# Altium schematic sheet sys.SchDoc: Systems (Debugging)
size A4; DocumentNumber: 8; SheetNumber: 8; SheetTotal: 8
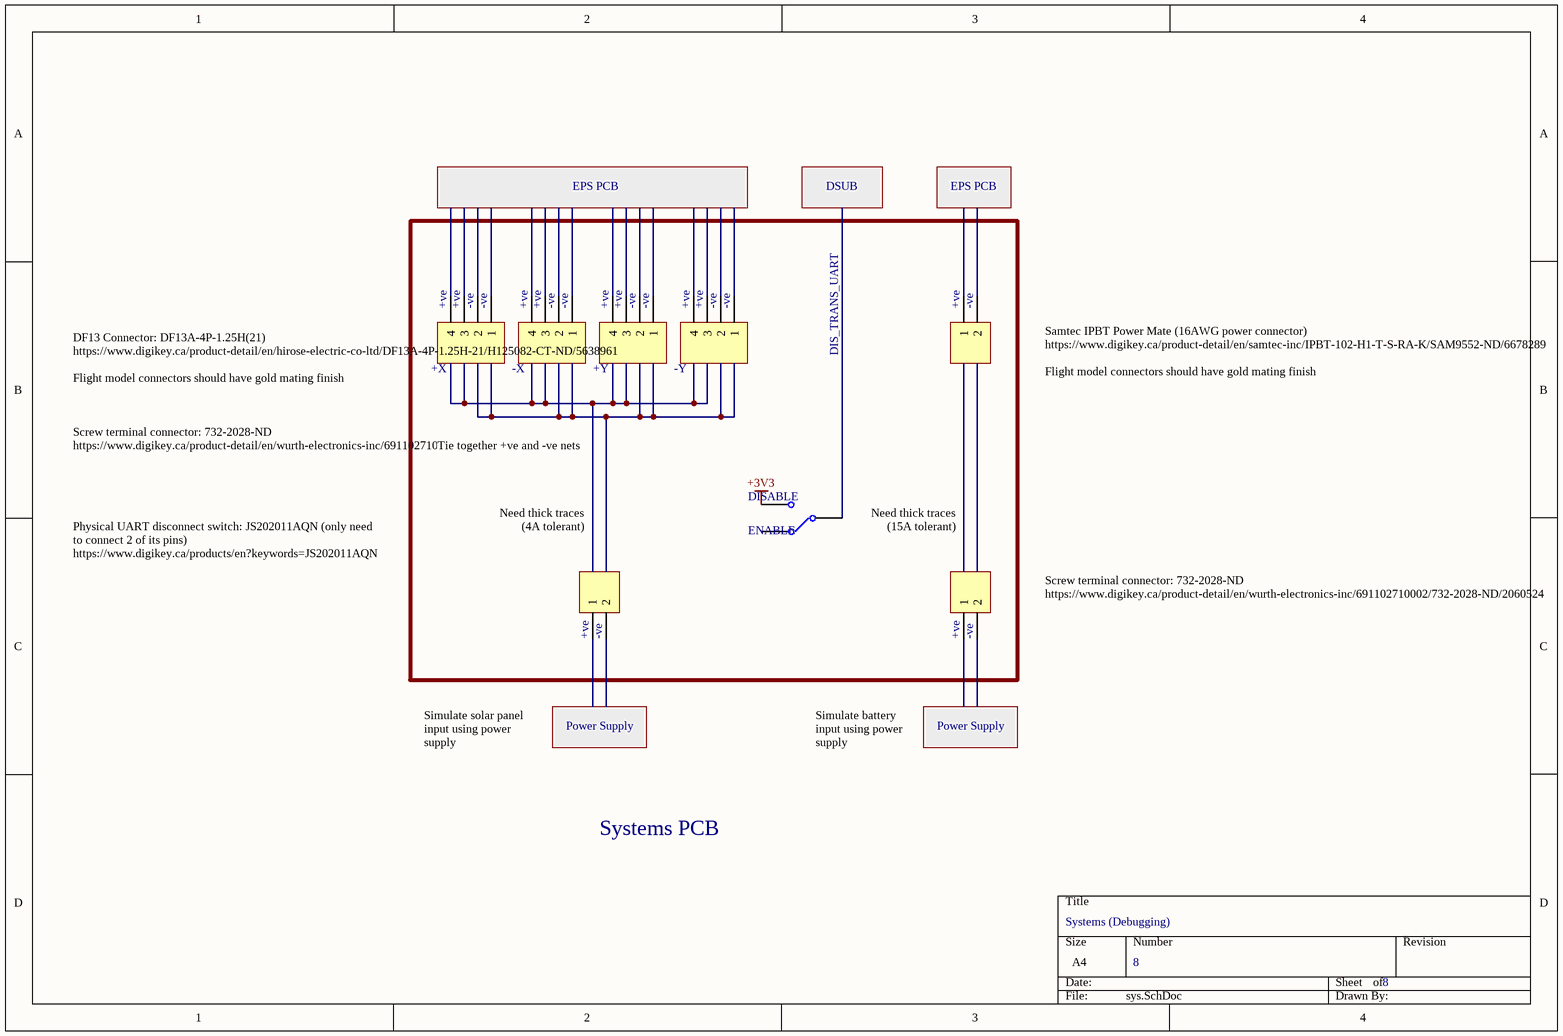
[diagram p0: sys.SchDoc]

## Parts
(Parts that share a designator on the sheet are numbered #1, #2 ... from top to bottom, then left to right.)
P?#1  Header 4  [HDR1X4]  (value not drawn)
P?#2  Header 4  [HDR1X4]  (value not drawn)
P?#3  Header 4  [HDR1X4]  (value not drawn)
P?#4  Header 4  [HDR1X4]  (value not drawn)
P?#5  Header 2  [HDR1X2]  (value not drawn)
P?#6  Header 2  [HDR1X2]  (value not drawn)
P?#7  Header 2  [HDR1X2]  (value not drawn)

## Nets

Not connected (* = marked no-connect by the designer): P?#1 1 2 3 4; P?#2 1 2 3 4; P?#3 1 2 3 4; P?#4 1 2 3 4; P?#5 1 2; P?#6 1 2; P?#7 1 2

## Notes on the sheet
- EPS PCB
- DSUB
- (near P?#1) +ve
- (near P?#1) -ve
- (near P?#2) +ve
- (near P?#2) -ve
- (near P?#3) +ve
- (near P?#3) -ve
- (near P?#4) +ve
- (near P?#4) -ve
- (near P?#5) +ve
- (near P?#5) -ve
- (near P?#1) +X
- (near P?#2) -X
- (near P?#3) +Y
- (near P?#4) -Y
- DIS_TRANS_UART
- DF13 Connector: DF13A-4P-1.25H(21)
  https://www.digikey.ca/product-detail/en/hirose-electric-co-ltd/DF13A-4P-1.25H-21/H125082-CT-ND/5638961
  Flight model connectors should have gold mating finish
- Tie together +ve and -ve nets
- Samtec IPBT Power Mate (16AWG power connector)
  https://www.digikey.ca/product-detail/en/samtec-inc/IPBT-102-H1-T-S-RA-K/SAM9552-ND/6678289
  Flight model connectors should have gold mating finish
- Screw terminal connector: 732-2028-ND
  https://www.digikey.ca/product-detail/en/wurth-electronics-inc/691102710002/732-2028-ND/2060524
- DISABLE
- Physical UART disconnect switch: JS202011AQN (only need to connect 2 of its pins)
  https://www.digikey.ca/products/en?keywords=JS202011AQN
- Need thick traces (4A tolerant)
- ENABLE
- Need thick traces
  (15A tolerant)
- (near P?#6) +ve
- (near P?#6) -ve
- (near P?#7) +ve
- (near P?#7) -ve
- Simulate solar panel input using power supply
- Power Supply
- Simulate battery input using power supply
- Systems PCB
- Labels drawn without touching a wire or pin: +3V3

## Library data of the parts
P?#1-P?#4 = Header 4: Header, 4-Pin; LatestRevisionDate: 17-Jul-2002; LatestRevisionNote: Re-released for DXP Platform.; Publisher: Altium Limited
P?#5-P?#7 = Header 2: Header, 2-Pin; LatestRevisionDate: 17-Jul-2002; LatestRevisionNote: Re-released for DXP Platform.; Publisher: Altium Limited